# Altium schematic sheet AudioCodec.SchDoc: Audio Codec
size Letter; Revision: 1.1; SheetNumber: 3
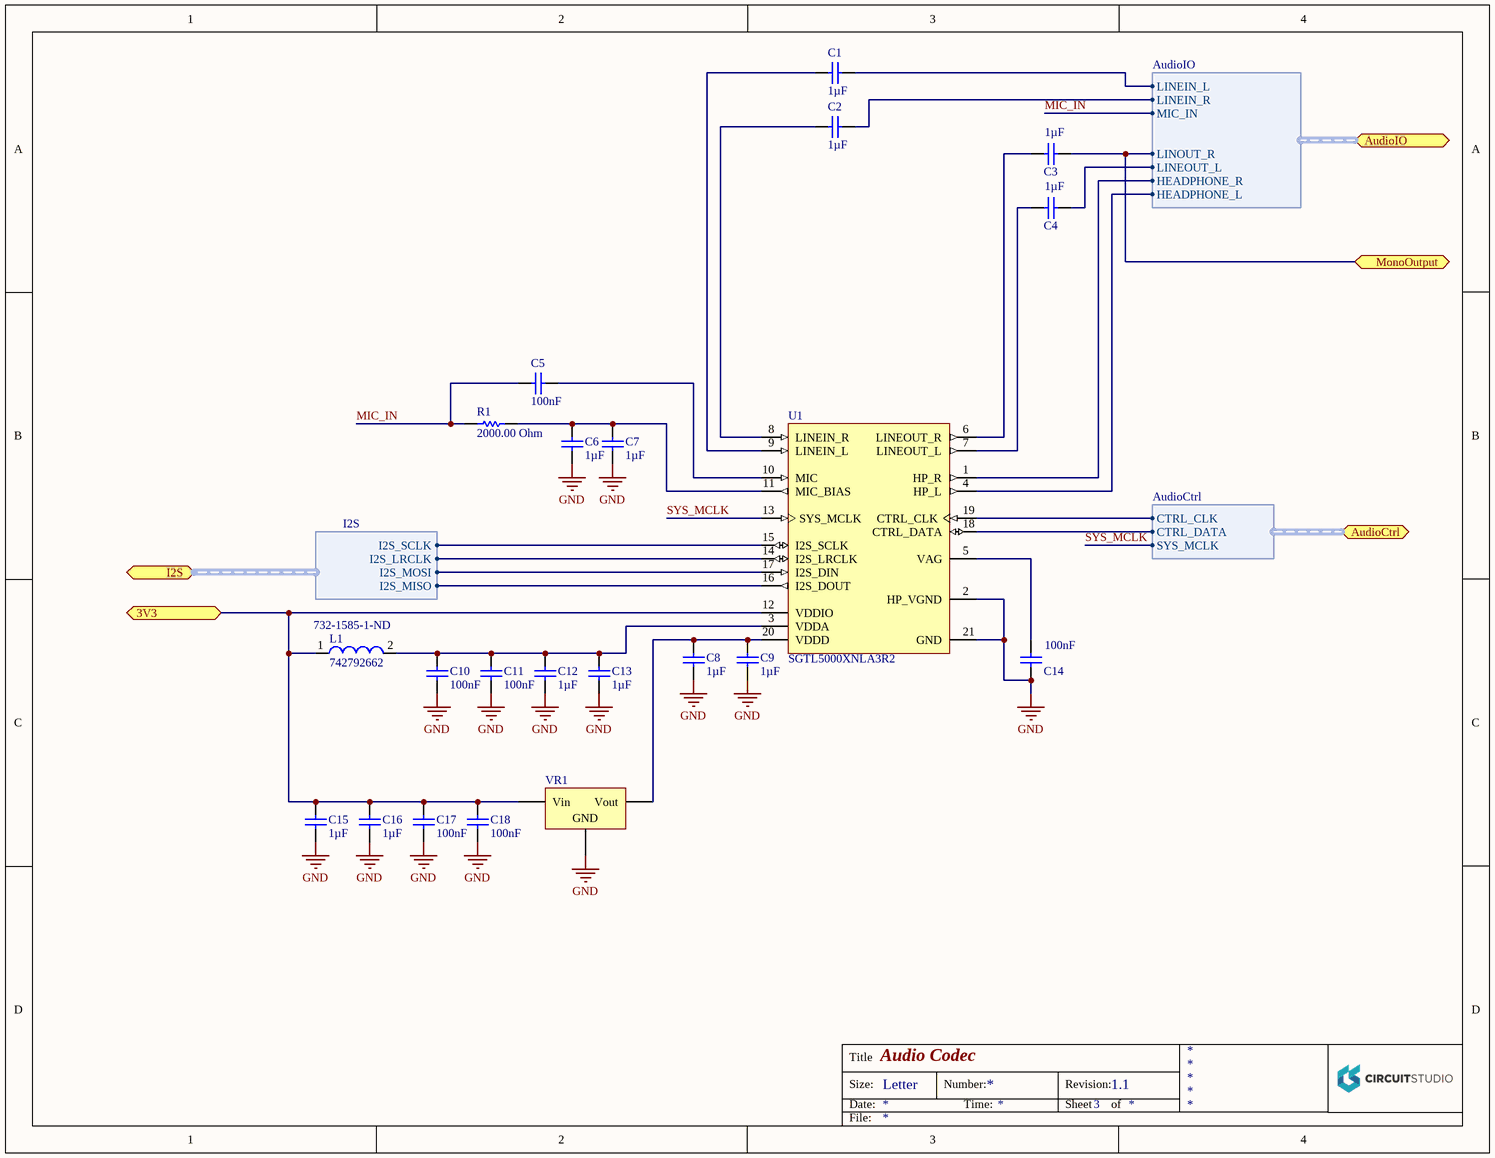
[diagram p0: AudioCodec.SchDoc]

## Parts
C1  Capacitance: 1µF  [CAPC1005X55X10ML05]  (hidden comment: C1005X5R1C105K050BC)
C2  Capacitance: 1µF  [CAPC1005X55X10ML05]  (hidden comment: C1005X5R1C105K050BC)
C3  Capacitance: 1µF  [CAPC1005X55X10ML05]  (hidden comment: C1005X5R1C105K050BC)
C4  Capacitance: 1µF  [CAPC1005X55X10ML05]  (hidden comment: C1005X5R1C105K050BC)
C5  Capacitance: 100nF  [CAPC1005X55X25NL05T10]  (hidden comment: GRM155R71C104KA88D)
C6  Capacitance: 1µF  [CAPC1005X55X10ML05]  (hidden comment: C1005X5R1C105K050BC)
C7  Capacitance: 1µF  [CAPC1005X55X10ML05]  (hidden comment: C1005X5R1C105K050BC)
C8  Capacitance: 1µF  [CAPC1005X55X10ML05]  (hidden comment: C1005X5R1C105K050BC)
C9  Capacitance: 1µF  [CAPC1005X55X10ML05]  (hidden comment: C1005X5R1C105K050BC)
C10  Capacitance: 100nF  [CAPC1005X55X25NL05T10]  (hidden comment: GRM155R71C104KA88D)
C11  Capacitance: 100nF  [CAPC1005X55X25NL05T10]  (hidden comment: GRM155R71C104KA88D)
C12  Capacitance: 1µF  [CAPC1005X55X10ML05]  (hidden comment: C1005X5R1C105K050BC)
C13  Capacitance: 1µF  [CAPC1005X55X10ML05]  (hidden comment: C1005X5R1C105K050BC)
C14  Capacitance: 100nF  [CAPC1005X55X25NL05T10]  (hidden comment: GRM155R71C104KA88D)
C15  Capacitance: 1µF  [CAPC1005X55X10ML05]  (hidden comment: C1005X5R1C105K050BC)
C16  Capacitance: 1µF  [CAPC1005X55X10ML05]  (hidden comment: C1005X5R1C105K050BC)
C17  Capacitance: 100nF  [CAPC1005X55X25NL05T10]  (hidden comment: GRM155R71C104KA88D)
C18  Capacitance: 100nF  [CAPC1005X55X25NL05T10]  (hidden comment: GRM155R71C104KA88D)
L1  742792662  Supplier Part Number 1: 732-1585-1-ND  [SMD-0603]
R1  value 2000.00 Ohm  [RESC0402(1005)_N]  (hidden comment: 2K 5% 0402(1005))
U1  SGTL5000XNLA3R2  [FRES-2032-01_L]
VR1  Volt Reg  [SOT23_L]  (value not drawn)

## Ports
3V3, AudioCtrl (harness AudioCtrl), AudioIO (harness AudioIO), I2S (harness I2S), MonoOutput

## Harnesses
I2S: I2S_LRCLK, I2S_MISO, I2S_MOSI, I2S_SCLK
AudioCtrl: CTRL_CLK, CTRL_DATA, SYS_MCLK
AudioIO: LINEIN_R, LINEIN_L, MIC_IN, LINOUT_R, LINEOUT_L, HEADPHONE_R, HEADPHONE_L

## Nets
GND: C6.2 C7.2 C8.2 C9.2 C10.2 C11.2 C12.2 C13.2 C14.1 C15.2 C16.2 C17.2 C18.2 U1.2(HP_VGND) U1.21(GND) VR1.2(GND)
3V3: C15.1 C16.1 C17.1 C18.1 L1.1 U1.12(VDDIO) VR1.1(Vin) ; port 3V3
MIC_IN: C5.2 R1.1 ; port AudioIO.MIC_IN
MonoOutput: C3.1 ; port MonoOutput, port AudioIO.LINOUT_R
SYS_MCLK: U1.13(SYS_MCLK) ; port AudioCtrl.SYS_MCLK
NetC1_1: C1.1 ; port AudioIO.LINEIN_L
NetC1_2: C1.2 U1.9(LINEIN_L)
NetC2_1: C2.1 ; port AudioIO.LINEIN_R
NetC2_2: C2.2 U1.8(LINEIN_R)
NetC3_2: C3.2 U1.6(LINEOUT_R)
NetC4_1: C4.1 ; port AudioIO.LINEOUT_L
NetC4_2: C4.2 U1.7(LINEOUT_L)
NetC5_1: C5.1 U1.10(MIC)
NetC6_1: C6.1 C7.1 R1.2 U1.11(MIC_BIAS)
NetC8_1: C8.1 C9.1 U1.20(VDDD) VR1.3(Vout)
NetC10_1: C10.1 C11.1 C12.1 C13.1 L1.2 U1.3(VDDA)
NetC14_2: C14.2 U1.5(VAG)
NetU1_1: U1.1(HP_R) ; port AudioIO.HEADPHONE_R
NetU1_4: U1.4(HP_L) ; port AudioIO.HEADPHONE_L
NetU1_14: U1.14(I2S_LRCLK) ; port I2S.I2S_LRCLK
NetU1_15: U1.15(I2S_SCLK) ; port I2S.I2S_SCLK
NetU1_16: U1.16(I2S_DOUT) ; port I2S.I2S_MISO
NetU1_17: U1.17(I2S_DIN) ; port I2S.I2S_MOSI
NetU1_18: U1.18(CTRL_DATA) ; port AudioCtrl.CTRL_DATA
NetU1_19: U1.19(CTRL_CLK) ; port AudioCtrl.CTRL_CLK

## Notes on the sheet
- Title
- Size:
- Date:
- Letter
- Number:
- Time:
- Revision:
- Sheet
- of
- File:

## Library data of the parts
C1-C4 C6-C9 C12 C13 C15 C16 = CMP-2000-05003-1: Chip Capacitor, 1 uF, +/- 10%, 16 V, -55 to 85 degC, 0402 (1005 Metric), RoHS, Tape and Reel; PCN Part Number: MLCCPartNumberChange30/Nov/2012; Manufacturer: TDK; HOUSEPART: MF-CAP-0402-1uF; Online Catalog: CSeries,GeneralPurpose; Other Names: 445-4978-6; Temperature Coefficient: X5R; Product Training Modules: CSeriesGeneralApplicationsSEAT,CCV,andTVCLDesignToolsGuidetoReplacinganElectrolyticCapacitorwithanMLCC; Voltage - Rated: 16V; Packaging: Digi-Reel; Tolerance: ±10%; Lead Spacing: -; Size / Dimension: 0.039"Lx0.020"W(1.00mmx0.50mm); Lead Style: -; Operating Temperature: -55degC~85degC; Series: C; Datasheet Version: Oct-13; Applications: GeneralPurpose; Family: CeramicCapacitors; Height - Seated (Max): -; Standard Package: 1; RoHS Information: RoHSCertificate-MLCC; Ratings: -; Package Description: 2-Pin Surface Mount Device, Body 1 x 0.5 mm; Package / Case: 0402(1005Metric); Category: Capacitors; Package Reference: 402; Datasheet URL: https://datasheet.ciiva.com/14482/1756136-14482760.pdf; Manufacturer URL: http://www.tdk.com/; Features: -; Mounting Type: SurfaceMount,MLCC; Thickness (Max): 0.022"(0.55mm)
  C6-C9 C12 C13 C15 C16: Supplier 1: Digi-Key; Supplier Part Number 1: 445-4978-1-ND
C5 C10 C11 C14 C17 C18 = CMP-2100-03641-1: Chip Capacitor, 0.1 uF, +/- 10%, 16 V, -55 to 125 degC, 0402 (1005 Metric), RoHS, Tape and Reel; Manufacturer: Murata; HOUSEPART: MF-CAP-0402-0.1uF; Material: Ceramic; Insulation Resistance: 10GR; Voltage: 16V; Dielectric: X7R; REACH SVHC: NoSVHC; Depth: 0.5mm; Case/Package: 0402; Datasheet URL: http://psearch.en.murata.com/capacitor/product/GRM155R71C104KA88%23.pdf; Lead Free: LeadFree; Dielectric Material: Ceramic; Manufacturer URL: http://www.murata.com/; Min Operating Temperature: -55degC; Length: 1mm; Case Code (Metric): 1005; Radiation Hardening: No; Package Reference: 0402; RoHSCompliant: true; Datasheet Version: 42675.0; Thickness: 0.022inch; Packaging: TapeandReel; Voltage Rating (DC): 16V; Tolerance: 10%; Max Operating Temperature: 125degC; Package Description: 2-Pin Surface Mount Device, Body 1 x 0.5 mm; Mount: SurfaceMount; Height: 0.5mm; Width: 0.5mm; Number of Pins: 2; Voltage Rating: 16V; Case Code (Imperial): 0402; Termination: SMD/SMT; Package Quantity: 1
  C5 C10 C11 C17 C18: Supplier 1: Digi-Key; Supplier Part Number 1: 490-6328-1-ND
L1 = CMP-0220-00178-1: SMD EMI Suppression Ferrite Bead WE-CBF, Z = 1000 Ohm; PackageDescription: Chip Inductor, 2-Leads, Body 1.6 x 0.8 mm; PackageVersion: 2009; PackageReference: SMD-0603; ComponentLink1URL: http://www.we-online.com; ComponentLink2URL: http://www.we-online.de/katalog/media/pdf/742792662.pdf; Impedance: 1000 Ohm; DatasheetVersion: ver 1, Mar-2010; ComponentLink1Description: Manufacturer Link; ComponentLink2Description: Datasheet; Supplier 1: Digi-Key
R1 = CMP-1011-00081-1: 2K 0.063W 5% 0402 (1005 Metric)  SMD; HOUSEPART: MF-RES-0402-2K; Case-EIA: 0402; Case-Metric: 1005; Power: 0.063 W; Technology: SMT; Tolerance: 5 %; Supplier 1: Digi-Key; Supplier Part Number 1: P2.0KJCT-ND
U1 = CMP-1078-00004-1: Low Power Stereo Codec with Headphone Amp, 1.1 to 2 V, -40 to 85 degC, 20-Pin QFN-EP, RoHS, Tape and Reel; Manufacturer: Freescale Semiconductor; SYS_MCLK Rise/Fall Time: 0.5 to 10 ns; VDDD(V): 1.1 to 2; LINEOUT Output Impedance: 320 Ohm Typ.; VDDIO(V): 1.62 to 3.6; MIC Input Impedance: 2.9 KOhm Typ.; ComponentLink1Description: Manufacturer URL; ComponentLink2Description: Datasheet; Temperature Range: -40 to 85 degC; PartNumber: SGTL5000XNLA3R2; Packing: Tape and Reel; DatasheetVersion: Rev. 6.0; ComponentLink2URL: http://cache.freescale.com/files/analog/doc/data_sheet/SGTL5000.pdf?pspll=1&Parent_nodeId=1227651963351723867067&Parent_pageType=product; RoHS: TRUE; ComponentLink3URL: http://cache.freescale.com/files/shared/doc/package_info/98ARE10742D.pdf?&Parent_nodeId=&Parent_pageType=; ComponentLink1URL: http://www.freescale.com/; PackageVersion: Rev. O; Mounting Technology: Surface Mount; PackageReference: 2032-01; ComponentLink3Description: Package Specification; PackageDescription: 20-Pin Thermally Enhanced Quad Flat Non-Lead Package(QFN), Body 3 x 3 mm, Pitch 0.4 mm
VR1 = Volt Reg: Voltage Regulator; Published: 24-Mar-1999; LatestRevisionDate: 29-May-2009; LatestRevisionNote: IPC-7351 Footprint Added.; PackageReference: D2PAK; Publisher: Altium Limited; PackageDescription: 3-Pin Transistor Outline Package 2.54 mm Pitch, 15.1 mm Lead Span; Supplier 1: Digi-Key; Supplier Part Number 1: AP7313-18SAG-7DICT-ND